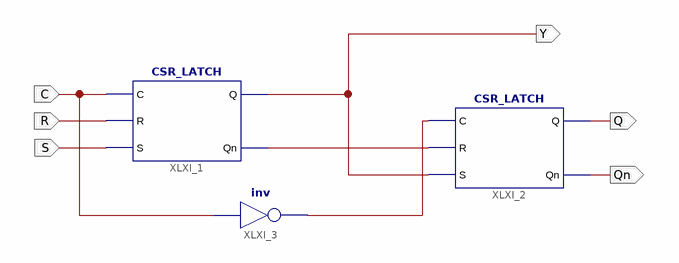
[diagram p0: schematic sheet 1]
// Xilinx ISE schematic MS_FLIPFLOP.sch (kintex7) as structural Verilog: 3 symbols, 6 ports
module MS_FLIPFLOP (
  input  S,
  input  R,
  input  C,
  output Y,
  output Q,
  output Qn
);

  wire XLXN_7, XLXN_9;

  CSR_LATCH XLXI_1 (.C(C), .R(R), .S(S), .Q(Y), .Qn(XLXN_7));
  CSR_LATCH XLXI_2 (.C(XLXN_9), .R(XLXN_7), .S(Y), .Q(Q), .Qn(Qn));
  not XLXI_3 (XLXN_9, C);
endmodule
